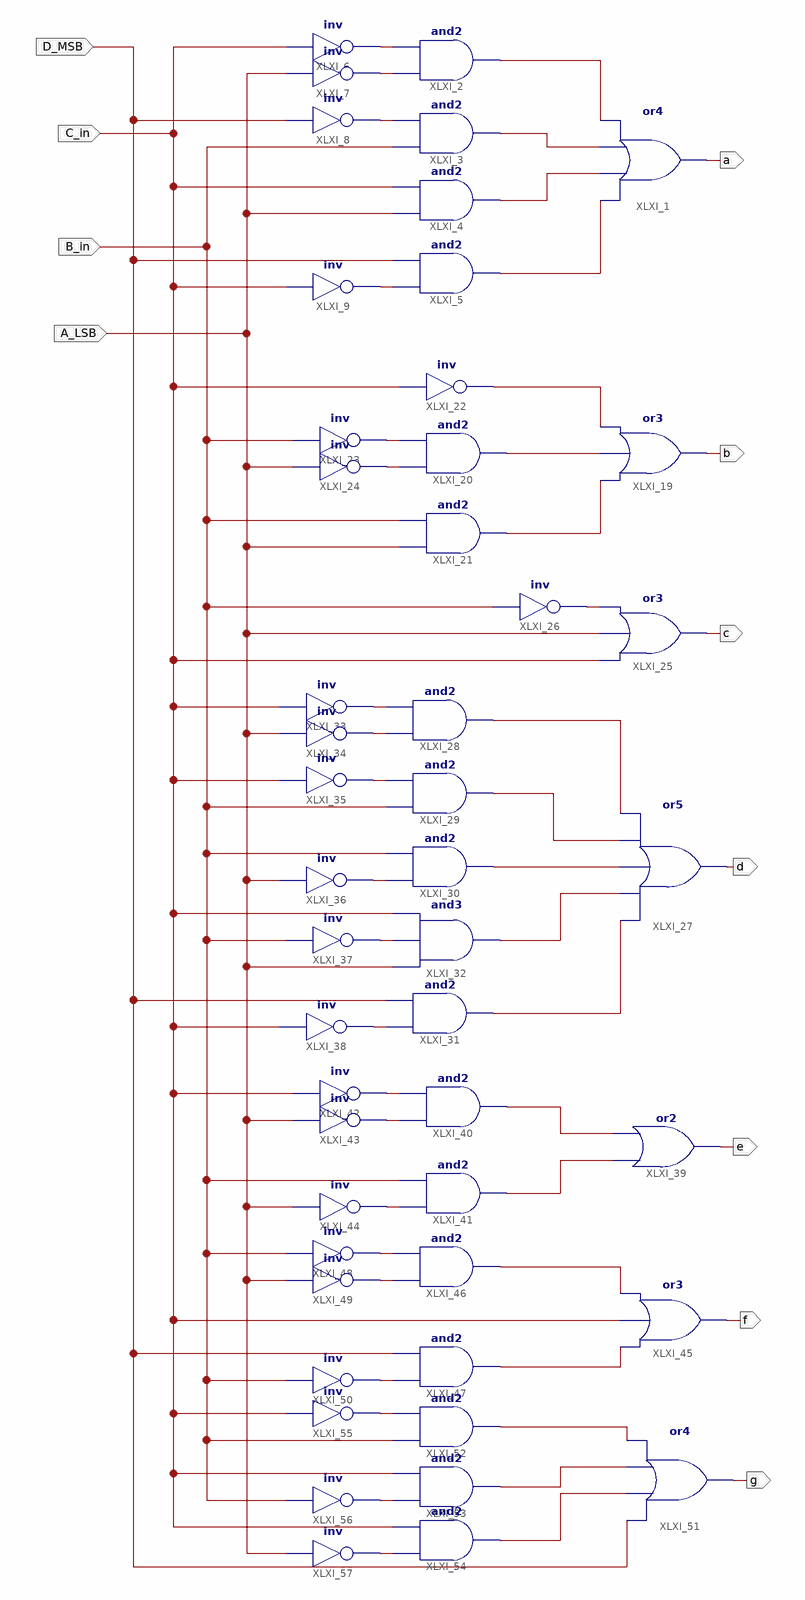
[diagram p0: schematic sheet 1]
// Xilinx ISE schematic segment.sch (spartan6) as structural Verilog: 48 symbols, 11 ports
module segment (
  input  D_MSB,
  input  C_in,
  input  B_in,
  input  A_LSB,
  output a,
  output b,
  output c,
  output d,
  output e,
  output f,
  output g
);

  wire XLXN_2, XLXN_3, XLXN_4, XLXN_5, XLXN_6, XLXN_7, XLXN_8, XLXN_9, XLXN_35, XLXN_37, XLXN_38, XLXN_39,
       XLXN_40, XLXN_47, XLXN_54, XLXN_55, XLXN_56, XLXN_57, XLXN_58, XLXN_59, XLXN_60, XLXN_61, XLXN_62,
       XLXN_63, XLXN_64, XLXN_77, XLXN_78, XLXN_79, XLXN_80, XLXN_81, XLXN_87, XLXN_88, XLXN_90, XLXN_91,
       XLXN_92, XLXN_98, XLXN_99, XLXN_100, XLXN_102, XLXN_103, XLXN_104;

  or XLXI_1 (a, XLXN_5, XLXN_4, XLXN_3, XLXN_2);
  and XLXI_2 (XLXN_2, XLXN_7, XLXN_6);
  and XLXI_3 (XLXN_3, B_in, XLXN_8);
  and XLXI_4 (XLXN_4, A_LSB, C_in);
  and XLXI_5 (XLXN_5, XLXN_9, D_MSB);
  not XLXI_6 (XLXN_6, C_in);
  not XLXI_7 (XLXN_7, A_LSB);
  not XLXI_8 (XLXN_8, D_MSB);
  not XLXI_9 (XLXN_9, C_in);
  or XLXI_19 (b, XLXN_40, XLXN_35, XLXN_39);
  and XLXI_20 (XLXN_35, XLXN_38, XLXN_37);
  and XLXI_21 (XLXN_40, A_LSB, B_in);
  not XLXI_22 (XLXN_39, C_in);
  not XLXI_23 (XLXN_37, B_in);
  not XLXI_24 (XLXN_38, A_LSB);
  or XLXI_25 (c, C_in, A_LSB, XLXN_47);
  not XLXI_26 (XLXN_47, B_in);
  and XLXI_28 (XLXN_54, XLXN_60, XLXN_59);
  and XLXI_29 (XLXN_55, B_in, XLXN_61);
  and XLXI_30 (XLXN_56, XLXN_62, B_in);
  and XLXI_32 (XLXN_57, A_LSB, XLXN_63, C_in);
  and XLXI_31 (XLXN_58, XLXN_64, D_MSB);
  or XLXI_27 (d, XLXN_58, XLXN_57, XLXN_56, XLXN_55, XLXN_54);
  not XLXI_33 (XLXN_59, C_in);
  not XLXI_34 (XLXN_60, A_LSB);
  not XLXI_35 (XLXN_61, C_in);
  not XLXI_36 (XLXN_62, A_LSB);
  not XLXI_37 (XLXN_63, B_in);
  not XLXI_38 (XLXN_64, C_in);
  or XLXI_39 (e, XLXN_78, XLXN_77);
  and XLXI_40 (XLXN_77, XLXN_80, XLXN_79);
  and XLXI_41 (XLXN_78, XLXN_81, B_in);
  not XLXI_42 (XLXN_79, C_in);
  not XLXI_43 (XLXN_80, A_LSB);
  not XLXI_44 (XLXN_81, A_LSB);
  or XLXI_45 (f, XLXN_88, C_in, XLXN_87);
  and XLXI_46 (XLXN_87, XLXN_91, XLXN_90);
  and XLXI_47 (XLXN_88, XLXN_92, D_MSB);
  not XLXI_48 (XLXN_90, B_in);
  not XLXI_49 (XLXN_91, A_LSB);
  not XLXI_50 (XLXN_92, B_in);
  or XLXI_51 (g, D_MSB, XLXN_100, XLXN_99, XLXN_98);
  and XLXI_52 (XLXN_98, B_in, XLXN_102);
  and XLXI_53 (XLXN_99, XLXN_103, C_in);
  and XLXI_54 (XLXN_100, XLXN_104, C_in);
  not XLXI_55 (XLXN_102, C_in);
  not XLXI_56 (XLXN_103, B_in);
  not XLXI_57 (XLXN_104, A_LSB);
endmodule
